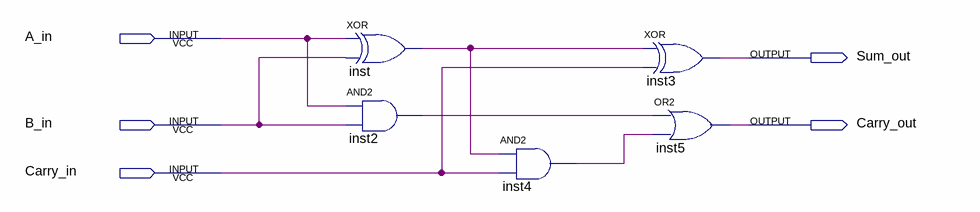
[diagram p0: schematic sheet]
// Quartus schematic Full_Adder.bdf as structural Verilog: 5 symbols, 5 pins
module Full_Adder (
  input  A_in,
  input  B_in,
  input  Carry_in,
  output Sum_out,
  output Carry_out
);

  wire inst2_out, inst4_out, inst_out;

  xor inst (inst_out, A_in, B_in);
  and inst2 (inst2_out, A_in, B_in);
  and inst4 (inst4_out, inst_out, Carry_in);
  xor inst3 (Sum_out, inst_out, Carry_in);
  or inst5 (Carry_out, inst2_out, inst4_out);
endmodule
